# EAGLE design plus10_fromScratch (EAGLE 8.6.3)
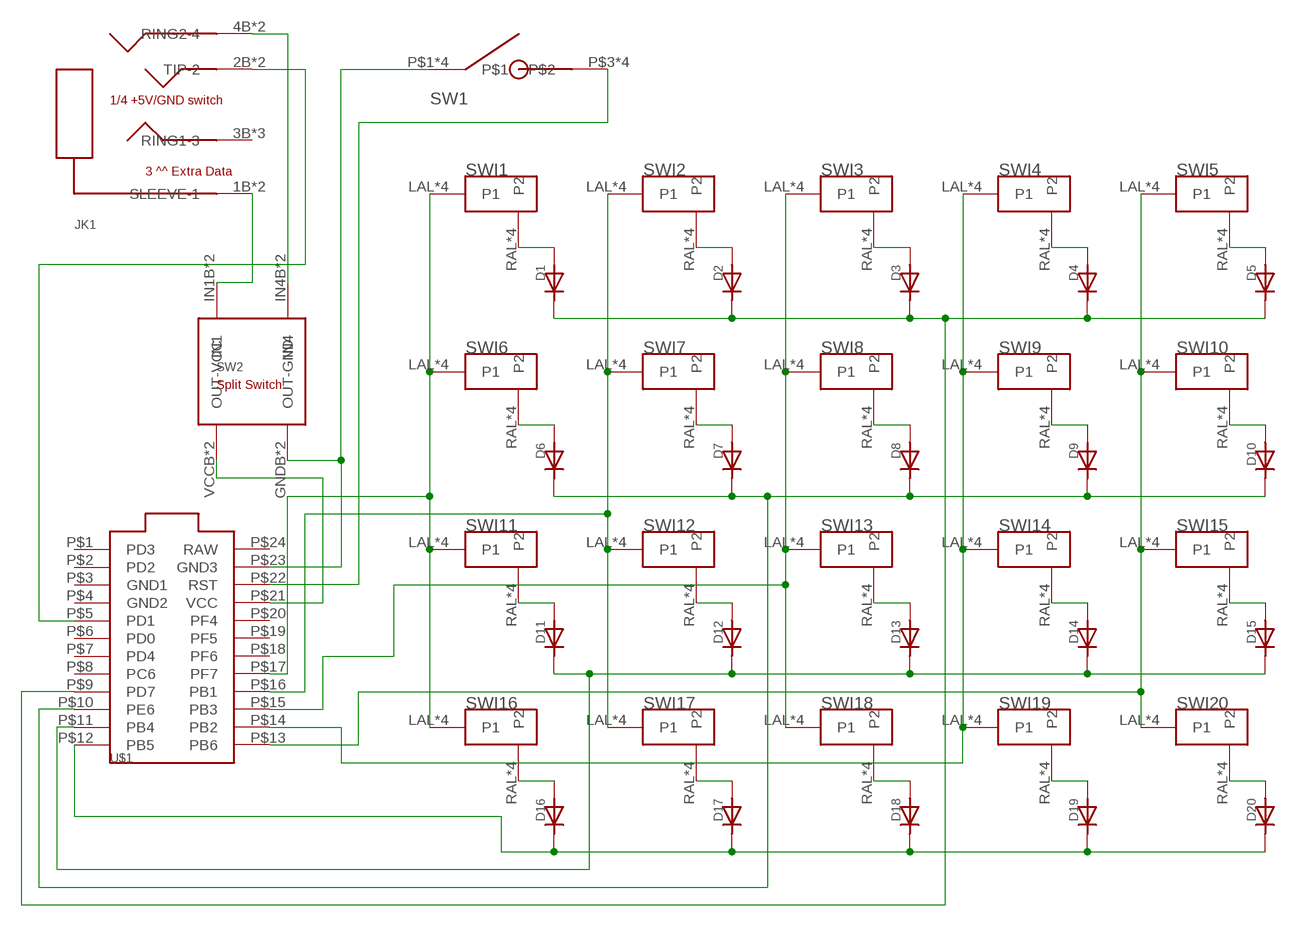
[diagram p0: schematic, sheet 1]

## Parts
D1  DIODE  [DIODE_COMBO]
D2  DIODE  [DIODE_COMBO]
D3  DIODE  [DIODE_COMBO]
D4  DIODE  [DIODE_COMBO]
D5  DIODE  [DIODE_COMBO]
D6  DIODE  [DIODE_COMBO]
D7  DIODE  [DIODE_COMBO]
D8  DIODE  [DIODE_COMBO]
D9  DIODE  [DIODE_COMBO]
D10  DIODE  [DIODE_COMBO]
D11  DIODE  [DIODE_COMBO]
D12  DIODE  [DIODE_COMBO]
D13  DIODE  [DIODE_COMBO]
D14  DIODE  [DIODE_COMBO]
D15  DIODE  [DIODE_COMBO]
D16  DIODE  [DIODE_COMBO]
D17  DIODE  [DIODE_COMBO]
D18  DIODE  [DIODE_COMBO]
D19  DIODE  [DIODE_COMBO]
D20  DIODE  [DIODE_COMBO]
JK1  TRRSJACK  [TRRSJACK]
SW1  RSTSWSMD  [FLATSWT]
SW2  TRANSFERPADDY  [TRANSFER_PADS]
SWI1  MX/ALPSDOUBLESIDED  [DOUBLED_MX/ALPS]
SWI2  MX/ALPSDOUBLESIDED  [DOUBLED_MX/ALPS]
SWI3  MX/ALPSDOUBLESIDED  [DOUBLED_MX/ALPS]
SWI4  MX/ALPSDOUBLESIDED  [DOUBLED_MX/ALPS]
SWI5  MX/ALPSDOUBLESIDED  [DOUBLED_MX/ALPS]
SWI6  MX/ALPSDOUBLESIDED  [DOUBLED_MX/ALPS]
SWI7  MX/ALPSDOUBLESIDED  [DOUBLED_MX/ALPS]
SWI8  MX/ALPSDOUBLESIDED  [DOUBLED_MX/ALPS]
SWI9  MX/ALPSDOUBLESIDED  [DOUBLED_MX/ALPS]
SWI10  MX/ALPSDOUBLESIDED  [DOUBLED_MX/ALPS]
SWI11  MX/ALPSDOUBLESIDED  [DOUBLED_MX/ALPS]
SWI12  MX/ALPSDOUBLESIDED  [DOUBLED_MX/ALPS]
SWI13  MX/ALPSDOUBLESIDED  [DOUBLED_MX/ALPS]
SWI14  MX/ALPSDOUBLESIDED  [DOUBLED_MX/ALPS]
SWI15  MX/ALPSDOUBLESIDED  [DOUBLED_MX/ALPS]
SWI16  MX/ALPSDOUBLESIDED  [DOUBLED_MX/ALPS]
SWI17  MX/ALPSDOUBLESIDED  [DOUBLED_MX/ALPS]
SWI18  MX/ALPSDOUBLESIDED  [DOUBLED_MX/ALPS]
SWI19  MX/ALPSDOUBLESIDED  [DOUBLED_MX/ALPS]
SWI20  MX/ALPSDOUBLESIDED  [DOUBLED_MX/ALPS]
U$1  PROMICROUNDER  [PROMICRO_UNDER]

## Nets
N$1: D1.ANOSB(AN) D1.ANOST(AN) D1.ANOT(AN) SWI1.RAL(P2) SWI1.RAR(P2) SWI1.RCL(P2) SWI1.RCR(P2)
N$2: SWI4.LAL(P1) SWI4.LAR(P1) SWI4.LCL(P1) SWI4.LCR(P1) SWI9.LAL(P1) SWI9.LAR(P1) SWI9.LCL(P1) SWI9.LCR(P1) SWI14.LAL(P1) SWI14.LAR(P1) SWI14.LCL(P1) SWI14.LCR(P1) SWI19.LAL(P1) SWI19.LAR(P1) SWI19.LCL(P1) SWI19.LCR(P1) U$1.P$14(PB2)
N$3: SWI3.LAL(P1) SWI3.LAR(P1) SWI3.LCL(P1) SWI3.LCR(P1) SWI8.LAL(P1) SWI8.LAR(P1) SWI8.LCL(P1) SWI8.LCR(P1) SWI13.LAL(P1) SWI13.LAR(P1) SWI13.LCL(P1) SWI13.LCR(P1) SWI18.LAL(P1) SWI18.LAR(P1) SWI18.LCL(P1) SWI18.LCR(P1) U$1.P$15(PB3)
N$4: SWI5.LAL(P1) SWI5.LAR(P1) SWI5.LCL(P1) SWI5.LCR(P1) SWI10.LAL(P1) SWI10.LAR(P1) SWI10.LCL(P1) SWI10.LCR(P1) SWI15.LAL(P1) SWI15.LAR(P1) SWI15.LCL(P1) SWI15.LCR(P1) SWI20.LAL(P1) SWI20.LAR(P1) SWI20.LCL(P1) SWI20.LCR(P1) U$1.P$13(PB6)
N$5: D2.ANOSB(AN) D2.ANOST(AN) D2.ANOT(AN) SWI2.RAL(P2) SWI2.RAR(P2) SWI2.RCL(P2) SWI2.RCR(P2)
N$6: D3.ANOSB(AN) D3.ANOST(AN) D3.ANOT(AN) SWI3.RAL(P2) SWI3.RAR(P2) SWI3.RCL(P2) SWI3.RCR(P2)
N$7: D4.ANOSB(AN) D4.ANOST(AN) D4.ANOT(AN) SWI4.RAL(P2) SWI4.RAR(P2) SWI4.RCL(P2) SWI4.RCR(P2)
N$8: D5.ANOSB(AN) D5.ANOST(AN) D5.ANOT(AN) SWI5.RAL(P2) SWI5.RAR(P2) SWI5.RCL(P2) SWI5.RCR(P2)
N$9: D6.ANOSB(AN) D6.ANOST(AN) D6.ANOT(AN) SWI6.RAL(P2) SWI6.RAR(P2) SWI6.RCL(P2) SWI6.RCR(P2)
N$10: D7.ANOSB(AN) D7.ANOST(AN) D7.ANOT(AN) SWI7.RAL(P2) SWI7.RAR(P2) SWI7.RCL(P2) SWI7.RCR(P2)
N$11: D8.ANOSB(AN) D8.ANOST(AN) D8.ANOT(AN) SWI8.RAL(P2) SWI8.RAR(P2) SWI8.RCL(P2) SWI8.RCR(P2)
N$12: D9.ANOSB(AN) D9.ANOST(AN) D9.ANOT(AN) SWI9.RAL(P2) SWI9.RAR(P2) SWI9.RCL(P2) SWI9.RCR(P2)
N$13: D10.ANOSB(AN) D10.ANOST(AN) D10.ANOT(AN) SWI10.RAL(P2) SWI10.RAR(P2) SWI10.RCL(P2) SWI10.RCR(P2)
N$14: D11.ANOSB(AN) D11.ANOST(AN) D11.ANOT(AN) SWI11.RAL(P2) SWI11.RAR(P2) SWI11.RCL(P2) SWI11.RCR(P2)
N$15: D12.ANOSB(AN) D12.ANOST(AN) D12.ANOT(AN) SWI12.RAL(P2) SWI12.RAR(P2) SWI12.RCL(P2) SWI12.RCR(P2)
N$16: D13.ANOSB(AN) D13.ANOST(AN) D13.ANOT(AN) SWI13.RAL(P2) SWI13.RAR(P2) SWI13.RCL(P2) SWI13.RCR(P2)
N$17: D14.ANOSB(AN) D14.ANOST(AN) D14.ANOT(AN) SWI14.RAL(P2) SWI14.RAR(P2) SWI14.RCL(P2) SWI14.RCR(P2)
N$18: D15.ANOSB(AN) D15.ANOST(AN) D15.ANOT(AN) SWI15.RAL(P2) SWI15.RAR(P2) SWI15.RCL(P2) SWI15.RCR(P2)
N$19: D16.ANOSB(AN) D16.ANOST(AN) D16.ANOT(AN) SWI16.RAL(P2) SWI16.RAR(P2) SWI16.RCL(P2) SWI16.RCR(P2)
N$20: D17.ANOSB(AN) D17.ANOST(AN) D17.ANOT(AN) SWI17.RAL(P2) SWI17.RAR(P2) SWI17.RCL(P2) SWI17.RCR(P2)
N$21: D11.CATSB(CAT) D11.CATST(CAT) D11.CATT(CAT) D12.CATSB(CAT) D12.CATST(CAT) D12.CATT(CAT) D13.CATSB(CAT) D13.CATST(CAT) D13.CATT(CAT) D14.CATSB(CAT) D14.CATST(CAT) D14.CATT(CAT) D15.CATSB(CAT) D15.CATST(CAT) D15.CATT(CAT) U$1.P$11(PB4)
N$22: D6.CATSB(CAT) D6.CATST(CAT) D6.CATT(CAT) D7.CATSB(CAT) D7.CATST(CAT) D7.CATT(CAT) D8.CATSB(CAT) D8.CATST(CAT) D8.CATT(CAT) D9.CATSB(CAT) D9.CATST(CAT) D9.CATT(CAT) D10.CATSB(CAT) D10.CATST(CAT) D10.CATT(CAT) U$1.P$10(PE6)
N$23: D18.ANOSB(AN) D18.ANOST(AN) D18.ANOT(AN) SWI18.RAL(P2) SWI18.RAR(P2) SWI18.RCL(P2) SWI18.RCR(P2)
N$24: D16.CATSB(CAT) D16.CATST(CAT) D16.CATT(CAT) D17.CATSB(CAT) D17.CATST(CAT) D17.CATT(CAT) D18.CATSB(CAT) D18.CATST(CAT) D18.CATT(CAT) D19.CATSB(CAT) D19.CATST(CAT) D19.CATT(CAT) D20.CATSB(CAT) D20.CATST(CAT) D20.CATT(CAT) U$1.P$12(PB5)
N$25: SWI1.LAL(P1) SWI1.LAR(P1) SWI1.LCL(P1) SWI1.LCR(P1) SWI6.LAL(P1) SWI6.LAR(P1) SWI6.LCL(P1) SWI6.LCR(P1) SWI11.LAL(P1) SWI11.LAR(P1) SWI11.LCL(P1) SWI11.LCR(P1) SWI16.LAL(P1) SWI16.LAR(P1) SWI16.LCL(P1) SWI16.LCR(P1) U$1.P$17(PF7)
N$26: SWI2.LAL(P1) SWI2.LAR(P1) SWI2.LCL(P1) SWI2.LCR(P1) SWI7.LAL(P1) SWI7.LAR(P1) SWI7.LCL(P1) SWI7.LCR(P1) SWI12.LAL(P1) SWI12.LAR(P1) SWI12.LCL(P1) SWI12.LCR(P1) SWI17.LAL(P1) SWI17.LAR(P1) SWI17.LCL(P1) SWI17.LCR(P1) U$1.P$16(PB1)
N$30: JK1.1B(SLEEVE-1) JK1.1T(SLEEVE-1) SW2.IN1B(IN1) SW2.IN1T(IN1)
N$31: JK1.4B(RING2-4) JK1.4T(RING2-4) SW2.IN4B(IN4) SW2.IN4T(IN4)
N$32: JK1.2B(TIP-2) JK1.2T(TIP-2) U$1.P$5(PD1)
N$33: D1.CATSB(CAT) D1.CATST(CAT) D1.CATT(CAT) D2.CATSB(CAT) D2.CATST(CAT) D2.CATT(CAT) D3.CATSB(CAT) D3.CATST(CAT) D3.CATT(CAT) D4.CATSB(CAT) D4.CATST(CAT) D4.CATT(CAT) D5.CATSB(CAT) D5.CATST(CAT) D5.CATT(CAT) U$1.P$9(PD7)
N$34: D19.ANOSB(AN) D19.ANOST(AN) D19.ANOT(AN) SWI19.RAL(P2) SWI19.RAR(P2) SWI19.RCL(P2) SWI19.RCR(P2)
N$35: D20.ANOSB(AN) D20.ANOST(AN) D20.ANOT(AN) SWI20.RAL(P2) SWI20.RAR(P2) SWI20.RCL(P2) SWI20.RCR(P2)
N$41: SW2.VCCB(OUT-VCC) SW2.VCCT(OUT-VCC) U$1.P$21(VCC)
N$42: SW1.P$1 SW1.P$2 SW1.P$5 SW1.P$6 SW2.GNDB(OUT-GND) SW2.GNDT(OUT-GND) U$1.P$23(GND3)
N$43: SW1.P$3 SW1.P$4 SW1.P$7 SW1.P$8 U$1.P$22(RST)
Unconnected: JK1.3B(RING1-3) JK1.3T(RING1-3) JK1.EXTRA_DATA(RING1-3) U$1.P$1(PD3) U$1.P$2(PD2) U$1.P$3(GND1) U$1.P$4(GND2) U$1.P$6(PD0) U$1.P$7(PD4) U$1.P$8(PC6) U$1.P$18(PF6) U$1.P$19(PF5) U$1.P$20(PF4) U$1.P$24(RAW)

## Library data of the parts
D1-D20 = Keys:DIODE
JK1 = Keys:TRRSJACK
SW1 = Keys:RSTSW
SW2 = Keys:TRANSFER
SWI1-SWI20 = Keys:MX/ALPS
U$1 = Keys:PROMICRO

## Board
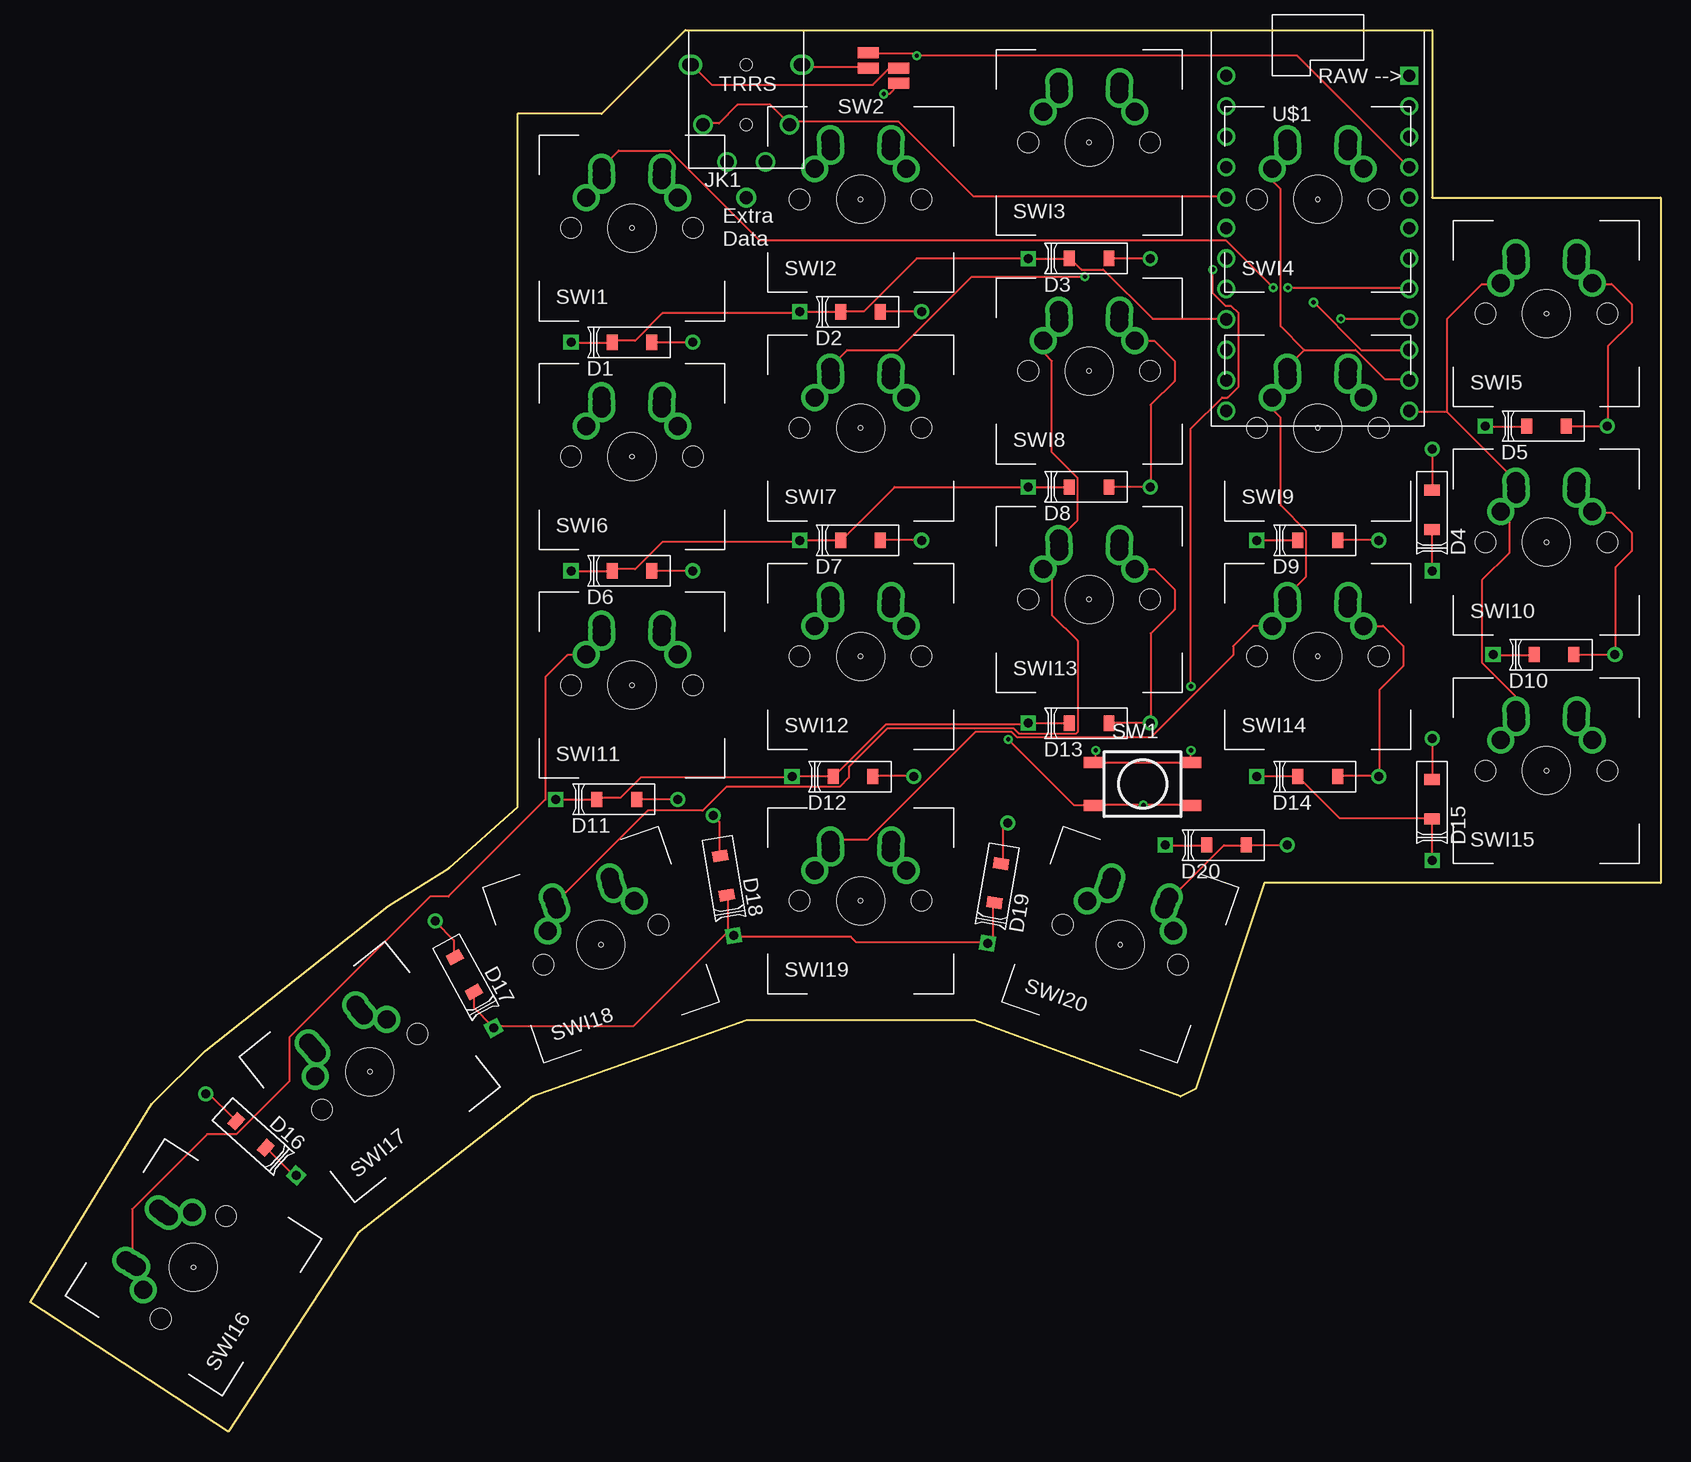
[diagram p1: board, top side]
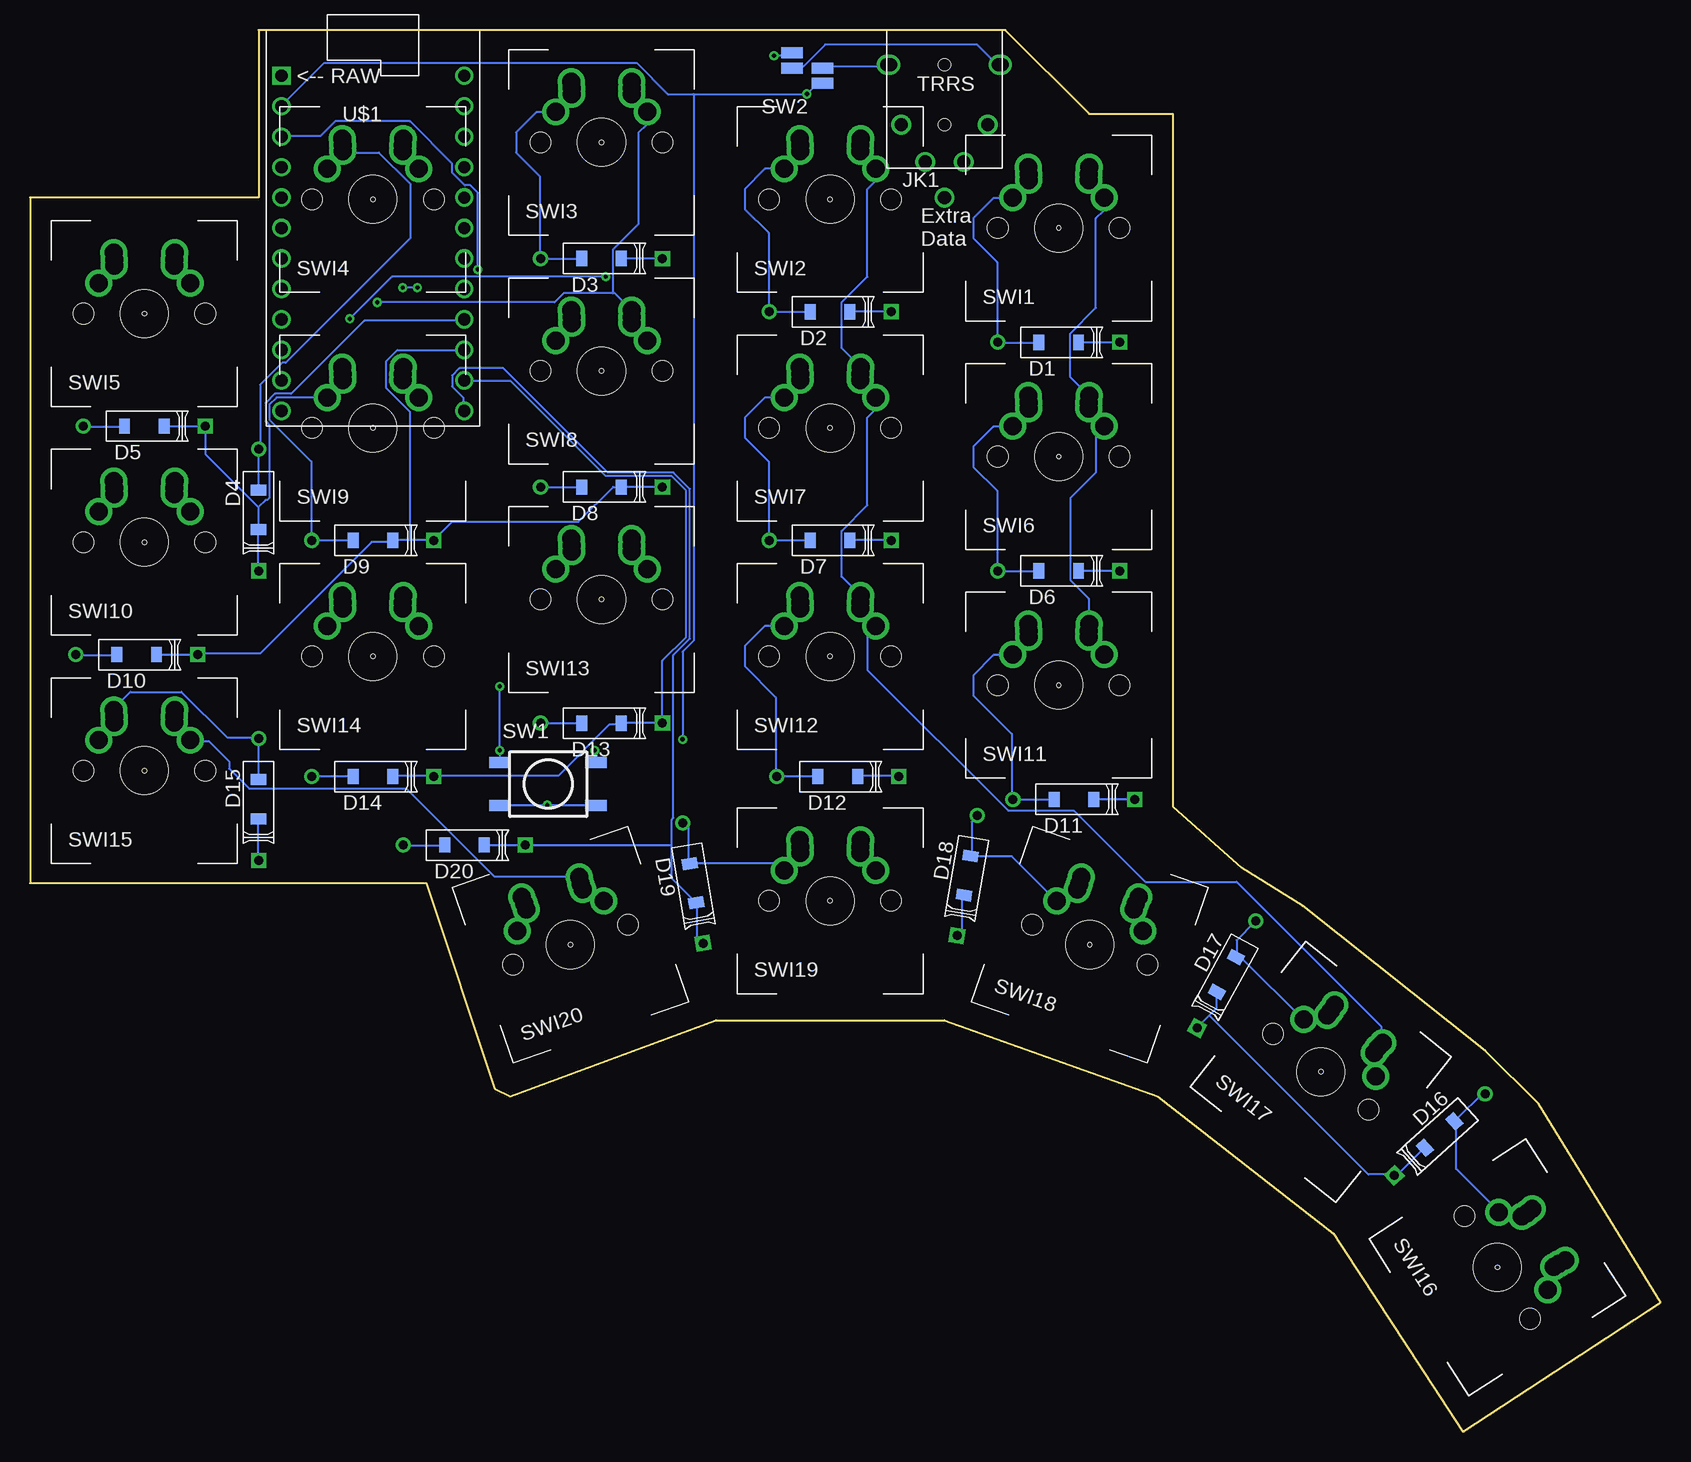
[diagram p2: board, bottom side, seen from below]

Size 135.89 x 116.84 mm. Coordinates in mm from the lower left corner, seen from the top.
Outline: 54.61,116.84 116.84,116.84 116.84,102.87 135.89,102.87 135.89,45.72 102.87,45.72 97.16,28.57 95.88,27.94 78.74,34.29 59.69,34.29 41.91,27.94 27.3,16.51 16.51,0 0,10.79 10.16,27.3 14.61,31.75 29.84,43.81 34.93,46.99 40.64,52.07 40.64,109.86 47.62,109.86 54.61,116.84
Copper layers (1*16): Top 0.035mm / dielectric 1.5mm / Bottom 0.035mm
Design rules "default": minimum track width 6mil, minimum drill 0.35mm, track to track 6mil, track to pad 6mil, pad to pad 6mil, via to via 6mil, smd to smd 6mil, copper to edge 40mil, drill to drill 6mil, minimum pad ring 10mil, minimum via ring 8mil, stop-mask expansion 4mil, vias tented up to drill 0mil, thermal gap 10mil

### Footprints (pad centres in the part's own frame; a part is rotated, then mirrored left to right if it is on the bottom)
DIODE_COMBO = smd 0.914 x 1.27 bottom: ANOSB 1.651,0; CATSB -1.651,0 | smd 0.914 x 1.27: ANOST 1.651,0; CATST -1.651,0 | drill 0.75: ANOT 5.08,0 | drill 0.75 square: CATT -5.08,0
TRRSJACK = drill 1.1: 1B 4.5,-2.9; 1T 4.8,-2.9; 2B 3.6,-7.9; 2T -3.6,-7.9; 3B -1.6,-11; 3T 1.6,-11; 4B -4.8,-2.9; 4T -4.5,-2.9; EXTRA_DATA 0,-13.97 | hole 1: 0,-2.9; 0,-7.9
FLATSWT = smd 1.778 x 0.914: P$1 -4,-1.8; P$2 4,-1.8; P$3 -4,1.8; P$4 4,1.8 | smd 1.778 x 0.914 bottom: P$5 -4,-1.8; P$6 4,-1.8; P$7 -4,1.8; P$8 4,1.8
TRANSFER_PADS = smd 1.778 x 0.914 bottom: GNDB -1.27,-1.27; IN1B -1.27,0; IN4B 1.27,0; VCCB 1.27,1.27 | smd 1.778 x 0.914: GNDT 1.27,-1.27; IN1T -1.27,0; IN4T 1.27,0; VCCT -1.27,1.27
DOUBLED_MX/ALPS = drill 1.5: LAL -2.5,4; LAR -2.5,4.5; RAL 2.5,4; RAR 2.5,4.5 | drill 1.499: LCL -3.81,2.54; LCR -2.54,5.08; RCL 3.81,2.54; RCR 2.54,5.08 | hole 0.35: 0,0 | hole 3.988: 0,0 | hole 1.702: -5.08,0; 5.08,0
PROMICRO_UNDER = drill 1.016: P$1 -7.62,0; P$2 -7.62,-2.54; P$3 -7.62,-5.08; P$4 -7.62,-7.62; P$5 -7.62,-10.16; P$6 -7.62,-12.7; P$7 -7.62,-15.24; P$8 -7.62,-17.78; P$9 -7.62,-20.32; P$10 -7.62,-22.86; P$11 -7.62,-25.4; P$12 -7.62,-27.94; P$13 7.62,-27.94; P$14 7.62,-25.4; P$15 7.62,-22.86; P$16 7.62,-20.32; P$17 7.62,-17.78; P$18 7.62,-15.24; P$19 7.62,-12.7; P$20 7.62,-10.16; P$21 7.62,-7.62; P$22 7.62,-5.08; P$23 7.62,-2.54 | drill 1.016 square: P$24 7.62,0

### Placement (x,y rotation side)
D1  50.16,90.81 0 top
D2  69.21,93.34 0 top
D3  88.27,97.79 0 top
D4  116.84,76.84 90 top
D5  126.36,83.82 0 top
D6  50.16,71.76 0 top
D7  69.21,74.3 0 top
D8  88.27,78.74 0 top
D9  107.31,74.3 0 top
D10  127,64.77 0 top
D11  48.9,52.7 0 top
D12  68.58,54.61 0 top
D13  88.27,59.05 0 top
D14  107.31,54.61 0 top
D15  116.84,52.7 90 top
D16  18.41,24.77 138 top
D17  36.2,38.1 118.7 top
D18  57.79,46.35 99.6 top
D19  80.64,45.72 80.4 top
D20  99.69,48.89 0 top
JK1  59.69,116.84 0 top
SW1  92.71,53.97 0 top
SW2  71.12,113.67 0 top
SWI1  50.16,100.33 0 top
SWI2  69.21,102.72 0 top
SWI3  88.27,107.47 0 top
SWI4  107.31,102.72 0 top
SWI5  126.36,93.19 0 top
SWI6  50.16,81.28 0 top
SWI7  69.21,83.67 0 top
SWI8  88.27,88.42 0 top
SWI9  107.31,83.67 0 top
SWI10  126.36,74.14 0 top
SWI11  50.16,62.23 0 top
SWI12  69.21,64.62 0 top
SWI13  88.27,69.37 0 top
SWI14  107.31,64.62 0 top
SWI15  126.36,55.09 0 top
SWI16  13.61,13.69 57.6 top
SWI17  28.32,30 38.4 top
SWI18  47.57,40.59 19.2 top
SWI19  69.21,44.25 0 top
SWI20  90.86,40.59 340.8 top
U$1  107.31,113.03 0 top

### Tracks (layer width: path | path; a pad name or v marks a point on that pad's centre or on a via)
N$1
  Top 0.152: D1.ANOST 51.94,90.78 55.14,90.78 D1.ANOT
  Bottom 0.152: D1.ANOST 51.94,90.78 55.14,90.78 D1.ANOT 55.3,90.93 55.3,97.48 57.28,99.47 57.28,101.14 55.6,102.82 54.08,102.82 SWI1.RCL
N$2
  Top 0.152: 103.61,105.26 103.61,105.56 104.67,106.63 SWI4.LAR 104.83,107.24 104.83,107.7 SWI4.LCR 104.67,106.78 SWI4.LAL | 103.61,86.21 103.61,86.51 104.67,87.58 SWI9.LAR 104.67,88.19 SWI9.LAL 104.67,87.73 SWI9.LCR 106.2,90.17 | 106.2,90.17 110.46,90.17 112.9,87.73 114.88,87.73 U$1.P$14 | 103.61,105.26 103.61,104.19 104.22,103.58 104.22,92.15 106.2,90.17 | 103.61,105.26 SWI4.LCL | SWI19.LCL 66.73,48.11 SWI19.LAR 66.73,48.87 66.73,49.33 | 66.73,49.33 SWI19.LCR 66.73,48.26 SWI19.LAL 66.73,49.33 | 104.83,69.14 104.83,69.6 SWI14.LCR 104.83,69.14 | 104.83,69.14 SWI14.LAL 104.67,68.53 103.61,67.46 103.61,67.16 SWI14.LCL 101.93,67.16 100.25,65.48 100.25,64.72 93.4,57.86 82.27,57.86 81.81,58.32 78.77,58.32 69.77,49.33 66.73,49.33 | 104.83,69.14 SWI14.LAR 104.83,69.75 106.35,71.27 106.35,75.08 104.22,77.22 104.22,84.53 103.61,85.14 103.61,86.21 | 103.61,86.21 SWI9.LCL
N$3  (via drill 0.35)
  Top 0.152: SWI3.LCL 84.56,110.13 85.78,111.35 SWI3.LAR 85.78,112.12 85.78,112.42 SWI3.LCR 85.78,111.51 SWI3.LAL | U$1.P$15 110.92,90.17 v106.96,94.13 | SWI8.LAL 85.78,92.3 84.56,91.08 SWI8.LCL 84.56,90.93 84.56,89.87 85.17,89.26 85.17,81.64 87.3,79.5 87.3,76 85.78,74.47 SWI13.LAR 85.78,73.86 SWI13.LCR 85.78,74.32 85.78,74.02 SWI13.LAL 85.78,73.25 84.56,72.03 SWI13.LCL 84.56,71.88 85.17,71.27 85.17,68.07 87.3,65.94 87.3,58.32 87.15,58.17 82.42,58.17 81.97,58.62 71.45,58.62 68.25,55.42 68.25,54.51 67.49,53.75 58.04,53.75 56.06,51.76 51.49,51.76 43.87,44.14 | 43.87,43.54 43.26,42.93 43.26,41.86 SWI18.LCL | 43.87,43.54 SWI18.LAR 43.87,44.14 | 43.87,44.14 43.56,44.45 SWI18.LCR 43.87,43.54 | 43.87,43.54 SWI18.LAL 43.87,44.14
  Bottom 0.152: v106.96,94.13 92.18,94.13 91.41,94.89 87.3,94.89 | 87.3,94.89 87.15,94.89 85.78,93.52 | 85.78,93.52 SWI8.LCR 85.78,92.91 SWI8.LAR | 85.78,93.52 SWI8.LAL | 87.3,94.89 87.3,98.55 85.17,100.69 85.17,108.31 84.56,108.92 84.56,109.98 SWI3.LCL
N$4
  Top 0.152: SWI20.LCL 88.21,44.3 88.98,44.3 89.74,45.06 SWI20.LAR 90.04,45.67 90.04,46.13 SWI20.LCR 89.74,45.21 SWI20.LAL | 123.72,97.18 122.66,96.11 122.66,95.81 SWI5.LCL 122.5,95.66 120.98,95.66 118.08,92.76 118.08,84.99 | 123.72,97.18 SWI5.LAR 123.88,97.79 123.88,98.25 SWI5.LCR 123.72,97.18 | 123.72,97.18 SWI5.LAL | 123.72,59.08 122.66,58.01 122.66,57.71 SWI15.LCL | 123.72,59.08 SWI15.LAR 123.88,59.69 123.88,60.15 SWI15.LCR | 123.72,59.08 SWI15.LAL | 123.72,59.08 SWI15.LCR | 118.08,84.99 115.04,84.99 U$1.P$13 | 123.72,79.35 118.08,84.99 | 123.72,78.13 122.66,77.06 122.66,76.76 SWI10.LCL 122.66,76.61 123.27,76 123.27,73.25 120.98,70.97 120.98,64.11 123.72,61.37 123.72,60.3 SWI15.LCR | 123.72,78.13 SWI10.LAR 123.72,79.35 | 123.72,79.35 SWI10.LCR 123.72,78.13 | 123.72,78.13 SWI10.LAL
  Bottom 0.152: SWI20.LCR 90.19,46.28 97.21,46.28 104.52,53.59 117.63,53.59 119.3,55.27 119.3,55.88 120.98,57.56 122.5,57.56 SWI15.LCL
N$5
  Top 0.152: D2.ANOST 70.99,93.37 74.19,93.37 D2.ANOT
  Bottom 0.152: D2.ANOST 70.99,93.37 74.19,93.37 D2.ANOT 74.35,93.37 74.35,99.92 76.33,101.91 76.33,103.58 74.65,105.26 SWI2.RCL
N$6
  Top 0.152: D3.ANOT D3.ANOST
  Bottom 0.152: D3.ANOST D3.ANOT 93.4,97.79 93.4,104.65 95.38,106.63 95.38,108.31 93.7,109.98 92.18,109.98 SWI3.RCL
N$7
  Top 0.152: D4.ANOST 116.86,78.59 116.86,81.79 D4.ANOT
  Bottom 0.152: D4.ANOST 116.86,78.59 116.86,81.79 D4.ANOT 116.71,81.94 116.71,87.27 114.88,89.1 114.58,89.1 104.22,99.47 104.22,104.04 106.81,106.63 109.7,106.63 SWI4.RAL
N$8
  Top 0.152: D5.ANOST 128.14,83.77 131.34,83.77 D5.ANOT 131.5,83.92 131.5,90.48 133.48,92.46 133.48,93.98 131.8,95.66 130.28,95.66 SWI5.RCL
  Bottom 0.152: D5.ANOST 128.14,83.77 131.34,83.77 D5.ANOT
N$9
  Top 0.152: D6.ANOST 51.94,71.73 55.14,71.73 D6.ANOT
  Bottom 0.152: D6.ANOST 51.94,71.73 55.14,71.73 D6.ANOT 55.3,71.88 55.3,78.44 57.28,80.42 57.28,82.09 55.6,83.77 54.08,83.77 SWI6.RCL
N$10
  Top 0.152: D7.ANOST 70.99,74.32 74.19,74.32 D7.ANOT
  Bottom 0.152: D7.ANOST 70.99,74.32 74.19,74.32 D7.ANOT 74.35,74.32 74.35,80.87 76.33,82.86 76.33,84.53 74.65,86.21 SWI7.RCL
N$11
  Top 0.152: D8.ANOST D8.ANOT 93.4,78.74 93.4,85.6 95.38,87.58 95.38,89.26 93.7,90.93 92.18,90.93 SWI8.RCL
  Bottom 0.152: D8.ANOT D8.ANOST
N$12
  Top 0.152: D9.ANOST 109.09,74.32 112.29,74.32 D9.ANOT
  Bottom 0.152: D9.ANOST 109.09,74.32 112.29,74.32 D9.ANOT 112.45,74.32 112.45,80.87 115.95,84.38 115.95,85.6 115.34,86.21 SWI9.RCL
N$13
  Top 0.152: D10.ANOST 128.75,64.72 131.95,64.72 D10.ANOT 132.11,64.87 132.11,72.03 133.48,73.41 133.48,74.93 131.8,76.61 130.28,76.61 SWI10.RCL
  Bottom 0.152: D10.ANOST 128.75,64.72 131.95,64.72 D10.ANOT
N$14
  Top 0.152: D11.ANOST 50.57,52.68 53.92,52.68 D11.ANOT
  Bottom 0.152: D11.ANOST 50.57,52.68 53.92,52.68 D11.ANOT 54.08,52.83 54.08,58.17 57.28,61.37 57.28,63.04 55.6,64.72 54.08,64.72 SWI11.RCL
N$15
  Top 0.152: D12.ANOST 70.23,54.66 73.58,54.66 D12.ANOT
  Bottom 0.152: D12.ANOST 70.23,54.66 73.58,54.66 D12.ANOT 73.74,54.66 73.74,61.21 76.33,63.8 76.33,65.48 74.65,67.16 SWI12.RCL
N$16
  Top 0.152: D13.ANOST 90.04,59.08 93.24,59.08 D13.ANOT 93.4,59.08 93.4,66.55 95.38,68.53 95.38,70.21 93.7,71.88 92.18,71.88 SWI13.RCL
  Bottom 0.152: D13.ANOST 90.04,59.08 93.24,59.08 D13.ANOT
N$17
  Top 0.152: D14.ANOST 109.09,54.66 112.29,54.66 D14.ANOT 112.45,54.66 112.45,61.82 114.43,63.8 114.43,65.48 112.75,67.16 SWI14.RCL
  Bottom 0.152: D14.ANOST 109.09,54.66 112.29,54.66 D14.ANOT
N$18
  Top 0.152: D15.ANOST 116.86,54.36 116.86,57.71 D15.ANOT
  Bottom 0.152: D15.ANOST 116.86,54.36 116.86,57.71 D15.ANOT 116.86,57.86 119.46,57.86 123.27,61.67 127.53,61.67 128.91,60.3 SWI15.RAR
N$19
  Top 0.152: D16.ANOST 17.04,26.01 14.76,28.3 D16.ANOT
  Bottom 0.152: D16.ANOT 14.76,28.3 17.04,26.01 D16.ANOST 17.04,25.86 17.04,21.89 13.54,18.39 SWI16.RCL
N$20
  Top 0.152: D17.ANOST 35.33,39.57 35.33,40.95 33.81,42.47 D17.ANOT
  Bottom 0.152: D17.ANOT 33.81,42.47 35.33,40.95 35.33,39.57 D17.ANOST 35.33,39.42 34.87,39.42 29.84,34.39 SWI17.RCL
N$21
  Top 0.152: D11.CATT 43.87,52.68 47.22,52.68 D11.CATSB 47.37,52.83 49.2,52.83 50.88,54.51 63.37,54.51 D12.CATT 63.52,54.66 66.88,54.66 D12.CATSB 67.03,54.66 71.3,58.93 83.18,58.93 D13.CATT 83.18,59.08 86.54,59.08 D13.CATSB | D15.CATT 116.86,47.65 116.86,51 D15.CATSB 116.71,51.16 109.09,51.16 105.74,54.51 D14.CATSB 105.59,54.66 102.23,54.66 D14.CATT
  Bottom 0.152: D11.CATSB 47.22,52.68 43.87,52.68 D11.CATT | D12.CATSB 66.88,54.66 63.52,54.66 D12.CATT | D15.CATSB 116.86,51 116.86,47.65 D15.CATT | 102.23,54.66 105.59,54.66 D14.CATSB | 83.18,59.08 86.54,59.08 D13.CATSB 86.69,58.93 87.6,58.93 91.87,54.66 102.23,54.66 | 83.18,59.08 83.18,64.26 81.2,66.24 81.2,78.44 82.42,79.65 87.91,79.65 95.83,87.58 99.64,87.58 U$1.P$11 | 83.18,59.08 D13.CATT | 102.23,54.66 D14.CATT
N$22
  Top 0.152: D8.CATSB D8.CATT 72.06,78.74 67.64,74.32 D7.CATSB 67.49,74.32 64.13,74.32 D7.CATT 64.13,74.17 52.71,74.17 50.42,71.88 48.59,71.88 D6.CATSB 48.44,71.73 45.09,71.73 D6.CATT | D10.CATSB 125.25,64.72 122.05,64.72 D10.CATT | D9.CATSB 105.59,74.32 102.23,74.32 D9.CATT
  Bottom 0.152: D8.CATT D8.CATSB 87.3,78.74 90.19,75.84 100.71,75.84 102.23,74.32 | D6.CATSB 48.44,71.73 45.09,71.73 D6.CATT | D7.CATSB 67.49,74.32 64.13,74.32 D7.CATT | D10.CATSB 125.25,64.72 122.05,64.72 D10.CATT 121.89,64.87 116.71,64.87 107.42,74.17 105.74,74.17 D9.CATSB 105.59,74.32 104.22,74.32 | 102.23,74.32 104.22,74.32 | U$1.P$10 105.28,90.17 106.2,89.26 106.2,86.97 104.22,84.99 104.22,74.32 | 102.23,74.32 D9.CATT
N$23
  Top 0.152: D18.ANOST 57.43,48.11 57.43,50.85 56.97,51.31 D18.ANOT
  Bottom 0.152: D18.ANOT 56.97,51.31 57.43,50.85 57.43,48.11 D18.ANOST 57.43,47.95 54.08,47.95 50.42,44.3 SWI18.RCL
N$24
  Top 0.152: D17.CATSB 37.01,36.52 37.01,35.31 38.53,33.78 D17.CATT 38.68,33.78 50.27,33.78 58.19,41.71 | D16.CATSB 19.79,23.57 22.07,21.29 D16.CATT | D20.CATSB 97.97,48.87 94.61,48.87 D20.CATT | 58.19,41.71 58.19,44.6 D18.CATSB | 58.19,41.71 58.5,41.4 D18.CATT | D19.CATSB 80.29,43.99 80.29,41.25 79.83,40.79 D19.CATT 79.68,40.79 68.86,40.79 68.4,41.25 58.65,41.25 D18.CATT | 58.19,41.71 D18.CATT
  Bottom 0.152: 37.62,34.7 38.53,33.78 D17.CATT | 37.62,34.7 37.01,35.31 37.01,36.52 D17.CATSB | D16.CATSB 19.79,23.57 22.07,21.29 D16.CATT 22.22,21.44 24.36,21.44 37.62,34.7 | 94.61,48.87 97.97,48.87 D20.CATSB | D18.CATSB 58.19,44.6 58.19,41.71 58.5,41.4 D18.CATT | D19.CATT 79.83,40.79 80.29,41.25 80.29,43.99 D19.CATSB 80.44,44.14 82.42,46.13 82.42,48.87 | 82.42,48.87 82.42,51 82.27,51.16 82.27,64.72 80.9,66.09 80.9,78.59 82.27,79.96 87.76,79.96 96.44,88.65 100.1,88.65 100.71,88.04 100.71,87.12 99.8,86.21 99.8,85.14 U$1.P$12 | 82.42,48.87 94.61,48.87 | 94.61,48.87 D20.CATT
N$25  (via drill 0.35)
  Top 0.152: v104.83,95.35 114.88,95.35 U$1.P$17 | v103.61,95.35 99.64,99.31 60.78,99.31 53.32,106.78 49.05,106.78 47.68,105.41 | SWI1.LCL 47.68,104.19 SWI1.LAR 47.68,105.41 | 47.68,105.41 SWI1.LCR 47.68,104.34 SWI1.LAL | SWI16.LCL 9.42,13.21 8.97,13.67 SWI16.LAL 8.36,14.12 8.05,14.12 SWI16.LCR 8.51,13.97 SWI16.LAR 8.51,14.12 8.51,18.54 14.76,24.79 17.2,24.79 21.61,29.21 21.61,32.87 33.35,44.6 34.87,44.6 42.95,52.68 42.95,62.89 44.78,64.72 46.3,64.72 SWI11.LCL 47.68,66.09 SWI11.LAR 47.68,66.85 47.68,67.31 SWI11.LCR 47.68,66.24 SWI11.LAL | SWI6.LCL 47.68,85.14 SWI6.LAL 47.68,85.9 | 47.68,85.9 47.68,86.36 SWI6.LCR 47.68,85.9 | 47.68,85.9 SWI6.LAR
  Bottom 0.152: v103.61,95.35 v104.83,95.35 | SWI11.LAL 47.68,67.31 47.68,69.44 49.2,70.97 49.2,77.83 47.07,79.96 47.07,83.16 46.46,83.77 SWI6.LCL | SWI1.LCL 46.46,102.82 46.46,101.75 47.07,101.14 47.07,93.67 49.2,91.54 49.2,87.88 47.68,86.36 SWI6.LAR
N$26  (via drill 0.35)
  Top 0.152: SWI2.LCL 65.51,105.26 65.51,105.56 66.57,106.63 SWI2.LAL 66.73,107.24 | 66.73,107.24 66.73,107.7 SWI2.LCR 66.73,107.24 | 66.73,107.24 SWI2.LAR | v109.24,92.76 114.88,92.76 U$1.P$16 | v87.91,96.27 78.46,96.27 72.36,90.17 68.1,90.17 66.73,88.8 | SWI7.LCL 65.51,86.21 65.51,86.51 66.57,87.58 SWI7.LAR 66.73,88.8 | 66.73,88.8 SWI7.LCR 66.57,87.73 SWI7.LAL | SWI17.LCR 23.29,32.26 23.44,32.11 SWI17.LAL | SWI17.LCL 23.75,29.67 23.75,31.5 SWI17.LCR | SWI17.LAR 23.6,31.95 SWI17.LCR | SWI12.LCL 65.51,67.16 65.51,67.46 66.57,68.53 SWI12.LAL 66.73,69.14 | 66.73,69.14 66.73,69.6 SWI12.LCR 66.73,69.14 | 66.73,69.14 SWI12.LAR
  Bottom 0.152: v109.24,92.76 105.74,96.27 v87.91,96.27 | SWI7.LCR 68.25,90.32 68.25,94.13 66.12,96.27 66.12,103.58 65.51,104.19 65.51,105.26 SWI2.LCL | SWI17.LAR 23.29,32.41 23.29,33.78 35.33,45.82 42.95,45.82 48.9,51.76 54.38,51.76 66.12,63.5 66.12,66.55 65.51,67.16 SWI12.LCL | SWI7.LCL 65.51,86.21 65.51,85.14 66.12,84.53 66.12,77.22 68.25,75.08 68.25,71.27 66.73,69.75 SWI12.LAR
N$30
  Top 0.152: SW2.IN1T 69.77,113.79 64.59,113.79 JK1.1T 64.44,113.94 64.29,113.94 JK1.1B
  Bottom 0.152: SW2.IN1T 69.77,113.79 64.59,113.79 JK1.1T
N$31
  Top 0.152: SW2.IN4T 72.36,113.64 71.6,113.64 70.23,112.27 56.82,112.27 55.3,113.79 JK1.4T 55.14,113.94 54.99,113.94 JK1.4B
  Bottom 0.152: SW2.IN4T 72.36,113.79 71.45,113.79 69.62,115.62 56.97,115.62 55.3,113.94 JK1.4T
N$32
  Top 0.152: U$1.P$5 99.64,102.97 78.61,102.97 72.36,109.22 63.52,109.22 63.37,109.07 JK1.2B 63.22,109.07 61.7,110.59 58.95,110.59 57.43,109.07 56.21,109.07 JK1.2T
N$33
  Top 0.152: D1.CATT 45.09,90.78 48.44,90.78 D1.CATSB 48.59,90.93 50.42,90.93 52.71,93.22 64.13,93.22 D2.CATT 64.13,93.37 67.49,93.37 D2.CATSB 67.64,93.37 69.47,93.37 73.89,97.79 D3.CATT D3.CATSB 86.69,97.79 87.6,96.88 89.43,96.88 93.55,92.76 99.64,92.76 U$1.P$9 | D4.CATSB 116.86,75.08 116.86,71.88 D4.CATT | D5.CATSB 124.64,83.77 121.28,83.77 D5.CATT
  Bottom 0.152: D1.CATSB 48.44,90.78 45.09,90.78 D1.CATT | D2.CATSB 67.49,93.37 64.13,93.37 D2.CATT | D4.CATT 116.86,71.88 116.86,75.08 D4.CATSB 116.86,75.23 116.86,77.06 | 121.28,83.77 124.64,83.77 D5.CATSB | 116.86,77.06 121.28,81.48 121.28,83.77 | 121.28,83.77 D5.CATT | D3.CATT D3.CATSB | 116.86,77.06 116.26,77.67 116.1,77.67 115.95,77.83 115.95,83.92 116.26,84.23 116.26,85.75 115.49,86.51 114.12,86.51 108.03,92.61 99.8,92.61 U$1.P$9
N$34
  Top 0.152: D19.ANOST 81.05,47.5 81.05,50.39 81.36,50.7 D19.ANOT
  Bottom 0.152: D19.ANOT 81.36,50.7 81.05,50.39 81.05,47.5 D19.ANOST 80.9,47.35 73.58,47.35 SWI19.RCL
N$35
  Top 0.152: D20.ANOT 104.67,48.87 101.47,48.87 D20.ANOST 101.32,48.87 99.49,48.87 95.07,44.45 SWI20.RAR
  Bottom 0.152: D20.ANOST 101.47,48.87 104.67,48.87 D20.ANOT
N$41  (via drill 0.35)
  Top 0.152: SW2.VCCT 69.93,114.86 73.74,114.86 v73.89,114.71 105.59,114.71 114.88,105.41 U$1.P$21
  Bottom 0.152: v73.89,114.71 72.67,114.71 72.52,114.86 SW2.VCCB
N$42  (via drill 0.35)
  Top 0.152: SW1.P$6 96.6,52.22 v92.79,52.22 88.82,52.22 SW1.P$5 88.67,52.22 86.99,52.22 v81.51,57.71 | v71.14,111.51 71.6,111.51 72.36,112.27 SW2.GNDT
  Bottom 0.152: SW1.P$5 88.82,52.22 v92.79,52.22 96.6,52.22 SW1.P$6 | SW2.GNDB 69.93,112.27 70.38,112.27 v71.14,111.51 80.59,111.51 | 80.59,111.51 82.73,111.51 85.32,114.1 111.38,114.1 114.88,110.59 U$1.P$23 | v81.51,57.71 81.51,65.02 80.59,65.94 80.59,111.51
N$43  (via drill 0.35)
  Top 0.152: v88.82,56.79 88.82,55.88 SW1.P$7 88.82,55.73 96.6,55.73 SW1.P$8 96.75,55.88 v96.75,56.79 | v98.58,96.88 98.58,94.89 99.64,93.83 100.1,93.83 100.71,93.22 100.71,87.12 99.8,86.21 99.34,86.21 96.75,83.62 v96.75,62.13
  Bottom 0.152: v88.82,56.79 88.82,55.88 SW1.P$7 | SW1.P$8 96.75,55.88 v96.75,56.79 v96.75,62.13 | v98.58,96.88 98.58,103.28 99.19,103.89 99.64,103.89 100.71,104.95 100.71,105.72 104.22,109.22 110.46,109.22 111.68,108 114.88,108 U$1.P$22